# EasyEDA schematic tiny_drone_controller.json
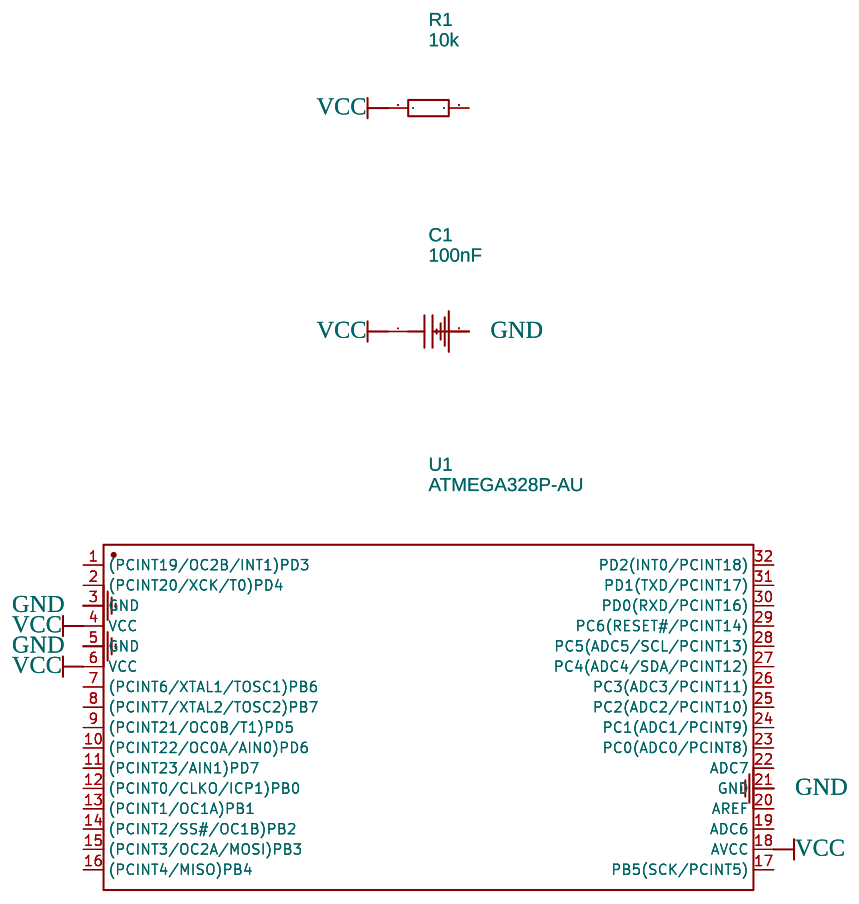
[diagram p0: schematic sheet]

## Parts
C1  100nF  [C0805]
R1  10k  [R0805]
U1  ATMEGA328P-AU  [TQFP-32_L7.0-W7.0-P0.80-LS9.0-BL]

## Library data of the parts
C1 = 100nF: Supplier: LCSC; Supplier Part: C49678
R1 = 10k: Supplier: LCSC; Supplier Part: C100047
U1 = ATMEGA328P-AU: Supplier: LCSC; Supplier Part: C14877

## Nets
GND: C1.2 U1.3(GND) U1.5(GND) U1.21(GND)
VCC: C1.1 R1.1 U1.4(VCC) U1.6(VCC) U1.18(AVCC)

Not connected (* = marked no-connect by the designer): R1 2; U1 1((PCINT19/OC2B/INT1)PD3) 2((PCINT20/XCK/T0)PD4) 7((PCINT6/XTAL1/TOSC1)PB6) 8((PCINT7/XTAL2/TOSC2)PB7) 9((PCINT21/OC0B/T1)PD5) 10((PCINT22/OC0A/AIN0)PD6) 11((PCINT23/AIN1)PD7) 12((PCINT0/CLKO/ICP1)PB0) 13((PCINT1/OC1A)PB1) 14((PCINT2/SS#/OC1B)PB2) 15((PCINT3/OC2A/MOSI)PB3) 16((PCINT4/MISO)PB4) 17(PB5(SCK/PCINT5)) 19(ADC6) 20(AREF) 22(ADC7) 23(PC0(ADC0/PCINT8)) 24(PC1(ADC1/PCINT9)) 25(PC2(ADC2/PCINT10)) 26(PC3(ADC3/PCINT11)) 27(PC4(ADC4/SDA/PCINT12)) 28(PC5(ADC5/SCL/PCINT13)) 29(PC6(RESET#/PCINT14)) 30(PD0(RXD/PCINT16)) 31(PD1(TXD/PCINT17)) 32(PD2(INT0/PCINT18))
